# EAGLE design mughug (EAGLE 8.5.2)
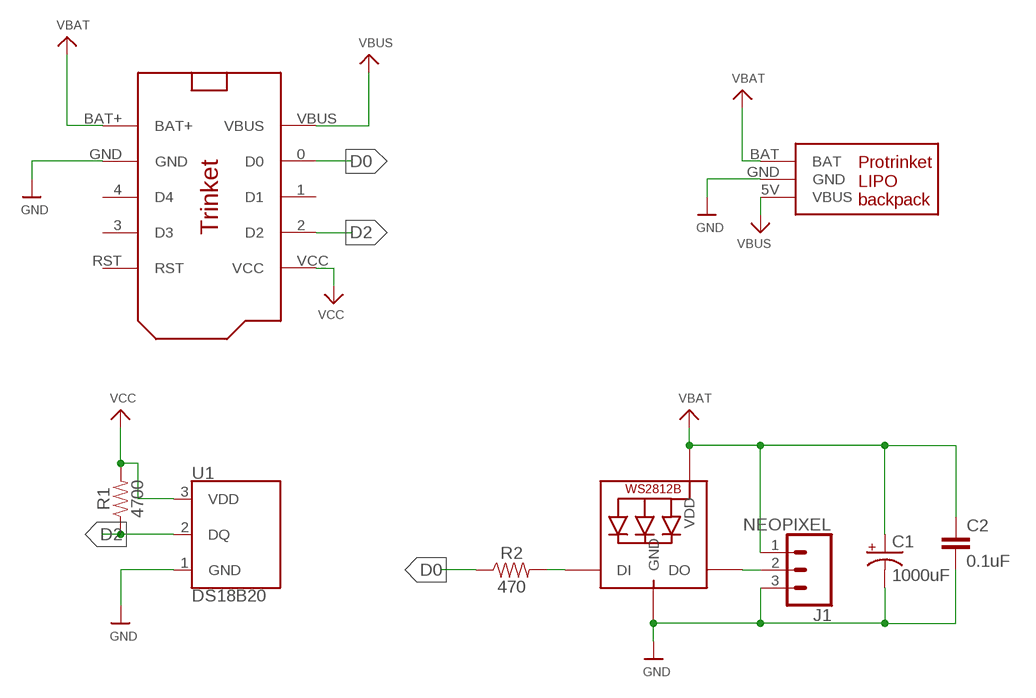
[diagram p0: schematic, sheet 1]

## Parts
C1  1000uF  CPOL-US150CLZ-0810  [150CLZ-0810]
C2  0.1uF  0.1UF-0603-25V-(+80/-20%)  [0603]
J1  NEOPIXEL  CONN_03  [1X03]
LED1  WS2812B5050  [WS2812B]
R1  4700  470OHM-0603-1/10W-1%  [0603]
R2  470  470OHM-0603-1/10W-1%  [0603]
U1  DS18B20  [TO-92-AMMO]
U$1  TRINKETNOHOLES  [TRINKET_NOHOLES]
U$2  PROTRINKETLIPO  [PROTRINKETLIPO_NOHOLE]

## Nets
D0: R2.1 U$1.0(D0)
D2: R1.1 U1.2(DQ) U$1.2(D2)
GND: C1.- C2.2 J1.3 LED1.3-GND(GND) U1.1(GND) U$1.GND U$2.GND
N$1: LED1.4-DIN(DI) R2.2
N$4: J1.2 LED1.2-DOUT(DO)
VBAT: C1.+ C2.1 J1.1 LED1.1-VDD(VDD) U$1.BAT+ U$2.BAT
VBUS: U$1.VBUS U$2.5V(VBUS)
VCC: R1.2 U1.3(VDD) U$1.VCC
Unconnected: U$1.1(D1) U$1.3(D3) U$1.4(D4) U$1.RST

## Library data of the parts
C1 = resistor:CPOL-US: POLARIZED CAPACITOR, American symbol
C2 = SparkFun-Capacitors:0.1UF: 0.1µF ceramic capacitors A capacitor is a passive two-terminal electrical component used to store electrical energy temporarily in an electric field.; PROD_ID: CAP-00810
J1 = SparkFun-Connectors:CONN_03: Multi connection point. Often used as Generic Header-pin footprint for 0.1 inch spaced/style header connections On any of the 0.1 inch spaced packages, you can populate with these: Break Away Headers - Straight <https://www.sparkfun.com/products/116> (PRT-00116) Break Away Male Headers - Right Angle <https://www.sparkfun.com/products/553> (PRT-00553) Female Headers <https://www.sparkfun.com/products/115> (PRT-00115) Break Away Headers - Machine Pin <https://www.sparkfun.com/products/117> (PRT-00117) Break Away Female Headers - Swiss Machine Pin <https://www.sparkfun.com/products/743> (PRT-00743) Stackable Header - 3 Pin (Female, 0.1") <https://www.sparkfun.com/products/13875> (PRT-13875) For SCREWTERMINALS and SPRING TERMINALS visit here: Screw Terimnals on SparkFun.com <https://www.sparkfun.com/search/results?term=Screw+Terminals> (5mm/3.5mm/2.54mm spacing) This device is also useful as a general connection point to wire up your design to another part of your project. Our various solder wires solder well into these plated through hole pads. Hook-Up Wire - Assortment (Stranded, 22 AWG) <https://www.sparkfun.com/products/11375> (PRT-11375) Hook-Up Wire - Assortment (Solid Core, 22 AWG) <https://www.sparkfun.com/products/11367> (PRT-11367) View the entire wire category on our website here <https://www.sparkfun.com/categories/141> Special notes: Molex polarized connector foot print use with SKU : PRT-08232 with associated crimp pins and housings.; PROD_ID: XXX-00000; VALUE: 455-1750-1-ND
LED1 = adafruit:WS2812B
R1 = SparkFun-Resistors:470OHM: 470Ω resistor A resistor is a passive two-terminal electrical component that implements electrical resistance as a circuit element. Resistors act to reduce current flow, and, at the same time, act to lower voltage levels within circuits. - Wikipedia; PROD_ID: RES-07869; VALUE: 470
R2 = SparkFun-Resistors:470OHM: 470Ω resistor A resistor is a passive two-terminal electrical component that implements electrical resistance as a circuit element. Resistors act to reduce current flow, and, at the same time, act to lower voltage levels within circuits. - Wikipedia; PROD_ID: RES-07869
U1 = SparkFun-Sensors:DS18B20: Dallas/Maxim DS18B20 1-Wire Temperature Sensor The DS18B20 reports degrees C with 9 to 12-bit precision, -55C to 125C (+/-0.5C). Each sensor has a unique 64-Bit Serial number etched into it - allows for a huge number of sensors to be used on one data bus. Datasheet <http://datasheets.maximintegrated.com/en/ds/DS18B20.pdf> SparkFun Products One Wire Digital Temperature Sensor - DS18B20 <https://www.sparkfun.com/products/245> (SEN-00245); STORE_ID: SEN-00245
U$1 = redhunter:TRINKET
U$2 = redhunter:PROTRINKETLIPO

## Board
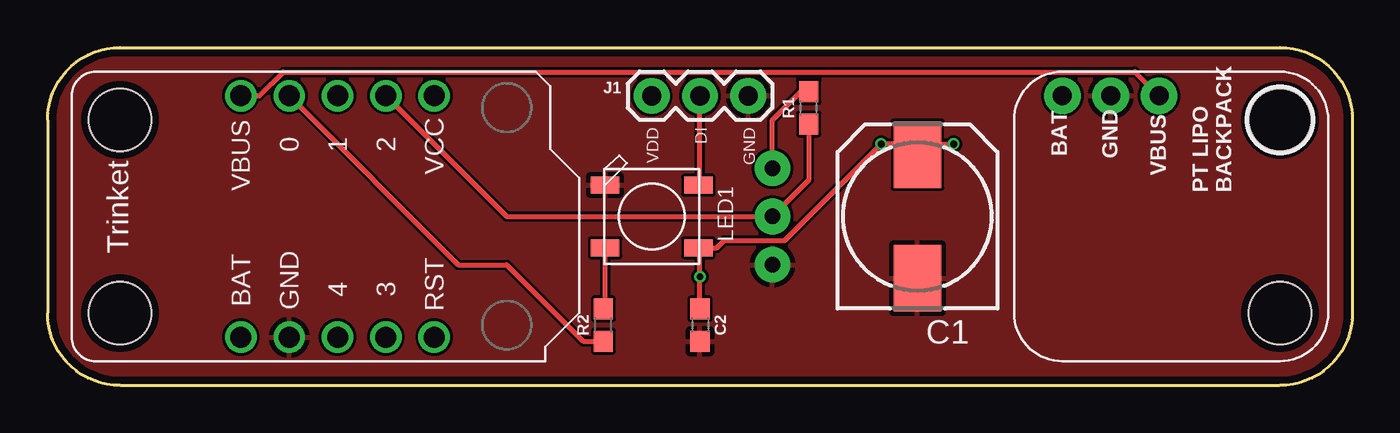
[diagram p1: board, top side]
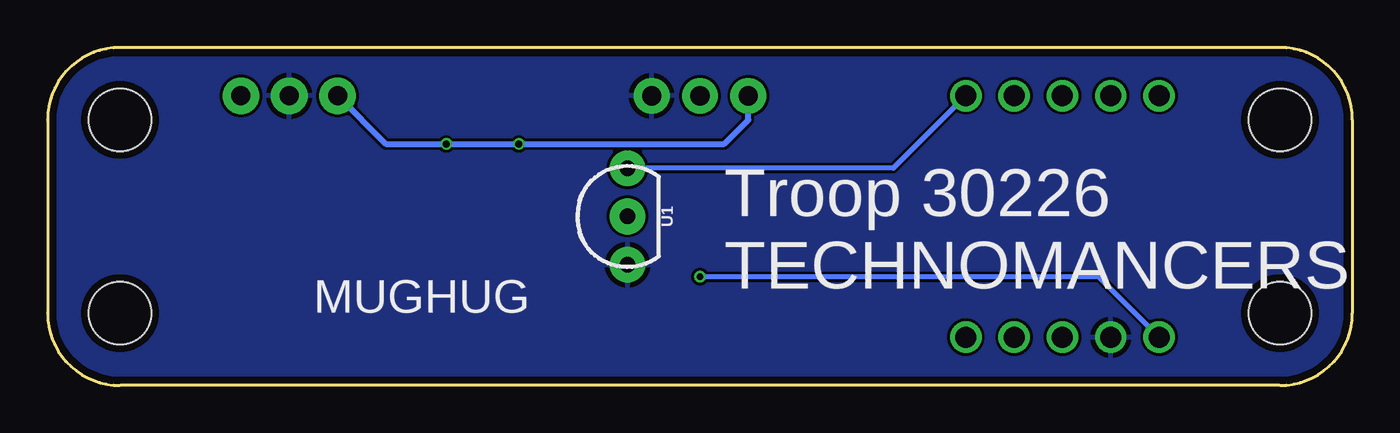
[diagram p2: board, bottom side, seen from below]

Size 68.58 x 17.78 mm. Coordinates in mm from the lower left corner, seen from the top.
Outline: 3.81,0 64.77,0 arc90 68.58,3.81 68.58,13.97 arc90 64.77,17.78 3.81,17.78 arc90 0,13.97 0,3.81 arc90 3.81,0
Copper layers (1*16): Top 0.035559375mm / dielectric 1.6mm / Bottom 0.035559375mm
Design rules "oshpark-2layer-tented": minimum track width 6mil, minimum drill 10mil, track to track 6mil, track to pad 6mil, pad to pad 6mil, via to via 6mil, smd to smd 6mil, copper to edge 15mil, drill to drill 6mil, minimum pad ring 5mil, minimum via ring 5mil, stop-mask expansion 2.5mil, vias tented up to drill 20mil, thermal gap 10mil

### Footprints (pad centres in the part's own frame; a part is rotated, then mirrored left to right if it is on the bottom)
150CLZ-0810 = smd 3.5 x 2.5: + 3.25,0; - -3.25,0
0603 = smd 1.1 x 1: 1 -0.85,0; 2 0.85,0
1X03 = drill 1.016 pad 1.88: 1 0,0; 2 2.54,0; 3 5.08,0
WS2812B = smd 1.5 x 0.9: 1-VDD 2.45,-1.65; 2-DOUT 2.45,1.65; 3-GND -2.45,1.65; 4-DIN -2.45,-1.65
TO-92-AMMO = drill 0.813 pad 1.88: 1 -2.54,0; 2 0,0; 3 2.54,0
TRINKET_NOHOLES = drill 1.1: 0 6.35,1.27; 1 6.35,-1.27; 2 6.35,-3.81; 3 -6.35,-3.81; 4 -6.35,-1.27; BAT+ -6.35,3.81; GND -6.35,1.27; RST -6.35,-6.35; VBUS 6.35,3.81; VCC 6.35,-6.35
PROTRINKETLIPO_NOHOLE = drill 1 pad 1.93: 5V 0,6.35; BAT -5.08,6.35; GND -2.54,6.35
STAND-OFF = hole 3.302: 0,0

### Placement (x,y rotation side)
C1  45.72,8.89 90 top
C2  34.29,3.17 270 top
J1  31.75,15.24 0 top
LED1  31.75,8.89 0 top
R1  40.01,14.61 90 top
R2  29.21,3.17 90 top
U1  38.1,8.89 90 bottom
U$1  13.97,8.89 90 top
U$2  58.42,8.89 0 top
U$9  [STAND-OFF]  3.81,13.97 0 top
U$10  [STAND-OFF]  3.81,3.81 0 top
U$11  [STAND-OFF]  64.77,13.97 0 top
U$12  [STAND-OFF]  64.77,3.81 0 top

### Tracks (layer width: path | path; a pad name or v marks a point on that pad's centre or on a via)
D0
  Top 0.254: U$1.0 21.59,6.35 24.13,6.35 28.16,2.33 R2.1
D2
  Top 0.254: U$1.2 24.13,8.89 U1.2 40.01,10.79 R1.1
GND
  pour Top: 0,0 0,17.78 68.58,17.78 68.58,0
  pour Bottom: 0,0 0,17.78 68.58,17.78 68.58,0
N$1
  Top 0.254: R2.2 29.3,4.12 LED1.4-DIN
N$4
  Top 0.254: LED1.2-DOUT 34.29,10.63 J1.2
VBAT  (via drill 0.35)
  Top 0.254: LED1.1-VDD 34.29,7.24 | 34.29,7.24 35.18,7.24 35.56,7.62 38.73,7.62 v43.81,12.7 45.16,12.7 C1.+ 46.28,12.7 v47.62,12.7 | C2.1 v34.29,5.71 34.29,7.24
  Bottom 0.254: U$1.BAT+ 13.34,5.71 v34.29,5.71
  Bottom 0.305: U$2.BAT 50.8,12.7 v47.62,12.7 v43.81,12.7 33.02,12.7 31.75,13.97 J1.1
VBUS
  Top 0.254: U$1.VBUS 11.14,15.24 12.38,16.48 57.12,16.48 57.15,16.51 U$2.5V
VCC
  Top 0.254: U1.3 38.1,13.97 39.59,15.46 R1.2
  Bottom 0.254: U$1.VCC 24.13,11.43 U1.3

### Text on the board
tPlace: VDD | DI | GND
bPlace: Troop 30226 / TECHNOMANCERS | MUGHUG